# Altium project NixieClock_B1.PrjPcb
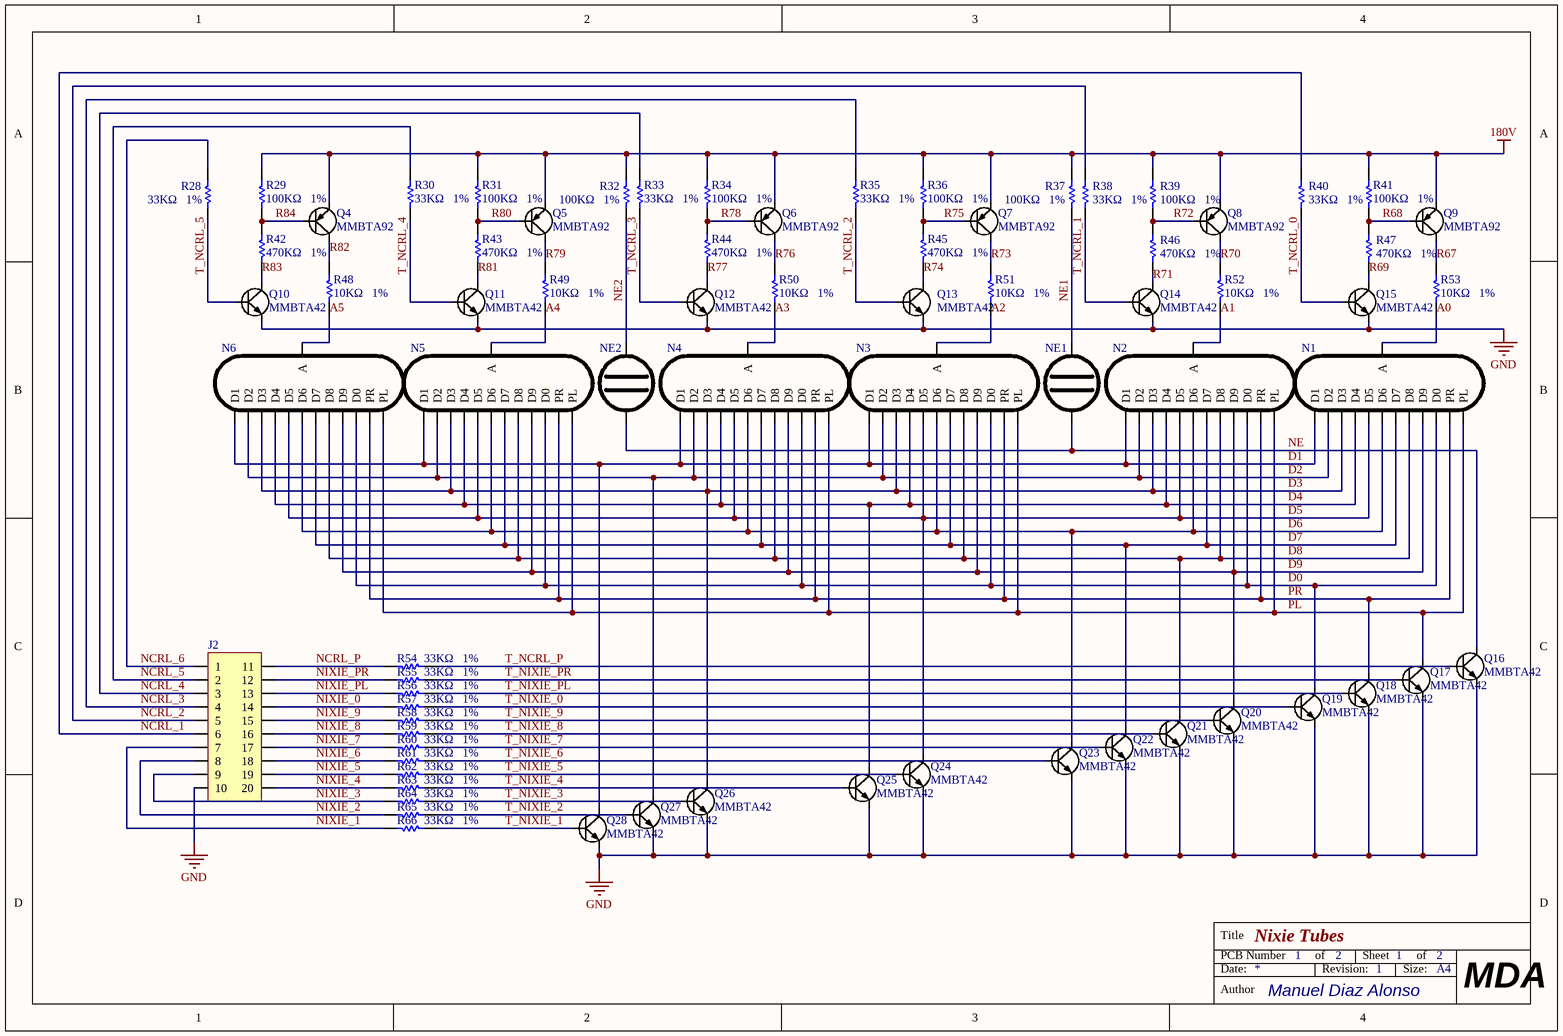
[diagram p0: nixie_tube.SchDoc]
2 sheets, 112 parts. Net scope: global (net labels, ports and power ports of the same name join across sheets).
Board file: NixieClock_B1.PcbDoc
Sheets:
  nixie_tube.SchDoc
  nixie_light.SchDoc

## Sheet nixie_tube.SchDoc: Nixie Tubes
size A4; Author: Manuel Diaz Alonso; Address1: 1; Address2: 2; Revision: 1; SheetNumber: 1; SheetTotal: 2

### Parts
J2  PIN_2X10  [PIN_2X10_HDR]  (value not drawn)
N1  NIXIE-IN14  [NIXIE_IN-14]  (value not drawn)
N2  NIXIE-IN14  [NIXIE_IN-14]  (value not drawn)
N3  NIXIE-IN14  [NIXIE_IN-14]  (value not drawn)
N4  NIXIE-IN14  [NIXIE_IN-14]  (value not drawn)
N5  NIXIE-IN14  [NIXIE_IN-14]  (value not drawn)
N6  NIXIE-IN14  [NIXIE_IN-14]  (value not drawn)
NE1  NIXIE-IN3  [NIXIE_IN-3]  (value not drawn)
NE2  NIXIE-IN3  [NIXIE_IN-3]  (value not drawn)
Q4  MMBTA92  [SOT-23]
Q5  MMBTA92  [SOT-23]
Q6  MMBTA92  [SOT-23]
Q7  MMBTA92  [SOT-23]
Q8  MMBTA92  [SOT-23]
Q9  MMBTA92  [SOT-23]
Q10  MMBTA42  [SOT-23]
Q11  MMBTA42  [SOT-23]
Q12  MMBTA42  [SOT-23]
Q13  MMBTA42  [SOT-23]
Q14  MMBTA42  [SOT-23]
Q15  MMBTA42  [SOT-23]
Q16  MMBTA42  [SOT-23]
Q17  MMBTA42  [SOT-23]
Q18  MMBTA42  [SOT-23]
Q19  MMBTA42  [SOT-23]
Q20  MMBTA42  [SOT-23]
Q21  MMBTA42  [SOT-23]
Q22  MMBTA42  [SOT-23]
Q23  MMBTA42  [SOT-23]
Q24  MMBTA42  [SOT-23]
Q25  MMBTA42  [SOT-23]
Q26  MMBTA42  [SOT-23]
Q27  MMBTA42  [SOT-23]
Q28  MMBTA42  [SOT-23]
R28  33KΩ   1%  [0603]
R29  100KΩ   1%  [0603]
R30  33KΩ   1%  [0603]
R31  100KΩ   1%  [0603]
R32  100KΩ   1%  [0603]
R33  33KΩ   1%  [0603]
R34  100KΩ   1%  [0603]
R35  33KΩ   1%  [0603]
R36  100KΩ   1%  [0603]
R37  100KΩ   1%  [0603]
R38  33KΩ   1%  [0603]
R39  100KΩ   1%  [0603]
R40  33KΩ   1%  [0603]
R41  100KΩ   1%  [0603]
R42  470KΩ   1%  [0603]
R43  470KΩ   1%  [0603]
R44  470KΩ   1%  [0603]
R45  470KΩ   1%  [0603]
R46  470KΩ   1%  [0603]
R47  470KΩ   1%  [0603]
R48  10KΩ   1%  [0603]
R49  10KΩ   1%  [0603]
R50  10KΩ   1%  [0603]
R51  10KΩ   1%  [0603]
R52  10KΩ   1%  [0603]
R53  10KΩ   1%  [0603]
R54  33KΩ   1%  [0603]
R55  33KΩ   1%  [0603]
R56  33KΩ   1%  [0603]
R57  33KΩ   1%  [0603]
R58  33KΩ   1%  [0603]
R59  33KΩ   1%  [0603]
R60  33KΩ   1%  [0603]
R61  33KΩ   1%  [0603]
R62  33KΩ   1%  [0603]
R63  33KΩ   1%  [0603]
R64  33KΩ   1%  [0603]
R65  33KΩ   1%  [0603]
R66  33KΩ   1%  [0603]

### Nets
180V: Q4.2(E) Q5.2(E) Q6.2(E) Q7.2(E) Q8.2(E) Q9.2(E) R29.2 R31.2 R32.2 R34.2 R36.2 R37.2 R39.2 R41.2
GND: J2.10 Q10.2(E) Q11.2(E) Q12.2(E) Q13.2(E) Q14.2(E) Q15.2(E) Q16.2(E) Q17.2(E) Q18.2(E) Q19.2(E) Q20.2(E) Q21.2(E) Q22.2(E) Q23.2(E) Q24.2(E) Q25.2(E) Q26.2(E) Q27.2(E) Q28.2(E)
A0: N1.1(A) R53.1
A1: N2.1(A) R52.1
A2: N3.1(A) R51.1
A3: N4.1(A) R50.1
A4: N5.1(A) R49.1
A5: N6.1(A) R48.1
D0: N1.12(D0) N2.12(D0) N3.12(D0) N4.12(D0) N5.12(D0) N6.12(D0) Q19.3(C)
D1: N1.3(D1) N2.3(D1) N3.3(D1) N4.3(D1) N5.3(D1) N6.3(D1) Q28.3(C)
D2: N1.4(D2) N2.4(D2) N3.4(D2) N4.4(D2) N5.4(D2) N6.4(D2) Q27.3(C)
D3: N1.5(D3) N2.5(D3) N3.5(D3) N4.5(D3) N5.5(D3) N6.5(D3) Q26.3(C)
D4: N1.6(D4) N2.6(D4) N3.6(D4) N4.6(D4) N5.6(D4) N6.6(D4) Q25.3(C)
D5: N1.7(D5) N2.7(D5) N3.7(D5) N4.7(D5) N5.7(D5) N6.7(D5) Q24.3(C)
D6: N1.8(D6) N2.8(D6) N3.8(D6) N4.8(D6) N5.8(D6) N6.8(D6) Q23.3(C)
D7: N1.9(D7) N2.9(D7) N3.9(D7) N4.9(D7) N5.9(D7) N6.9(D7) Q22.3(C)
D8: N1.10(D8) N2.10(D8) N3.10(D8) N4.10(D8) N5.10(D8) N6.10(D8) Q21.3(C)
D9: N1.11(D9) N2.11(D9) N3.11(D9) N4.11(D9) N5.11(D9) N6.11(D9) Q20.3(C)
NCRL_1: J2.6 R40.1
NCRL_2: J2.5 R38.2
NCRL_3: J2.4 R35.2
NCRL_4: J2.3 R33.1
NCRL_5: J2.2 R30.2
NCRL_6: J2.1 R28.2
NCRL_P: J2.11 R54.1
NE: NE1.2 NE2.2 Q16.3(C)
NE1: NE1.1 R37.1
NE2: NE2.1 R32.1
NIXIE_0: J2.14 R57.1
NIXIE_1: J2.7 R66.1
NIXIE_2: J2.8 R65.1
NIXIE_3: J2.9 R64.1
NIXIE_4: J2.20 R63.1
NIXIE_5: J2.19 R62.1
NIXIE_6: J2.18 R61.1
NIXIE_7: J2.17 R60.1
NIXIE_8: J2.16 R59.1
NIXIE_9: J2.15 R58.1
NIXIE_PL: J2.13 R56.1
NIXIE_PR: J2.12 R55.1
PL: N1.2(PL) N2.2(PL) N3.2(PL) N4.2(PL) N5.2(PL) N6.2(PL) Q17.3(C)
PR: N1.13(PR) N2.13(PR) N3.13(PR) N4.13(PR) N5.13(PR) N6.13(PR) Q18.3(C)
R67: Q9.3(C) R53.2
R68: Q9.1(B) R41.1 R47.2
R69: Q15.3(C) R47.1
R70: Q8.3(C) R52.2
R71: Q14.3(C) R46.1
R72: Q8.1(B) R39.1 R46.2
R73: Q7.3(C) R51.2
R74: Q13.3(C) R45.1
R75: Q7.1(B) R36.1 R45.2
R76: Q6.3(C) R50.2
R77: Q12.3(C) R44.1
R78: Q6.1(B) R34.1 R44.2
R79: Q5.3(C) R49.2
R80: Q5.1(B) R31.1 R43.2
R81: Q11.3(C) R43.1
R82: Q4.3(C) R48.2
R83: Q10.3(C) R42.1
R84: Q4.1(B) R29.1 R42.2
T_NCRL_0: Q15.1(B) R40.2
T_NCRL_1: Q14.1(B) R38.1
T_NCRL_2: Q13.1(B) R35.1
T_NCRL_3: Q12.1(B) R33.2
T_NCRL_4: Q11.1(B) R30.1
T_NCRL_5: Q10.1(B) R28.1
T_NCRL_P: Q16.1(B) R54.2
T_NIXIE_0: Q19.1(B) R57.2
T_NIXIE_1: Q28.1(B) R66.2
T_NIXIE_2: Q27.1(B) R65.2
T_NIXIE_3: Q26.1(B) R64.2
T_NIXIE_4: Q25.1(B) R63.2
T_NIXIE_5: Q24.1(B) R62.2
T_NIXIE_6: Q23.1(B) R61.2
T_NIXIE_7: Q22.1(B) R60.2
T_NIXIE_8: Q21.1(B) R59.2
T_NIXIE_9: Q20.1(B) R58.2
T_NIXIE_PL: Q18.1(B) R56.2
T_NIXIE_PR: Q17.1(B) R55.2

### Notes on the sheet
- Title
- PCB Number
- Date:
- of
- Revision:
- Sheet
- Size:
- A4
- Author
- MDA

### Library data of the parts
J2 = PIN_2X10: TSW-110-15-F-D-LL; System: Connector
Q4-Q9 = PNP
Q10-Q28 = NPN
R28-R66 = RES

## Sheet nixie_light.SchDoc: Nixie Lights
size A4; Author: Manuel Diaz Alonso; Address1: 1; Address2: 2; Revision: 1; SheetNumber: 2; SheetTotal: 2
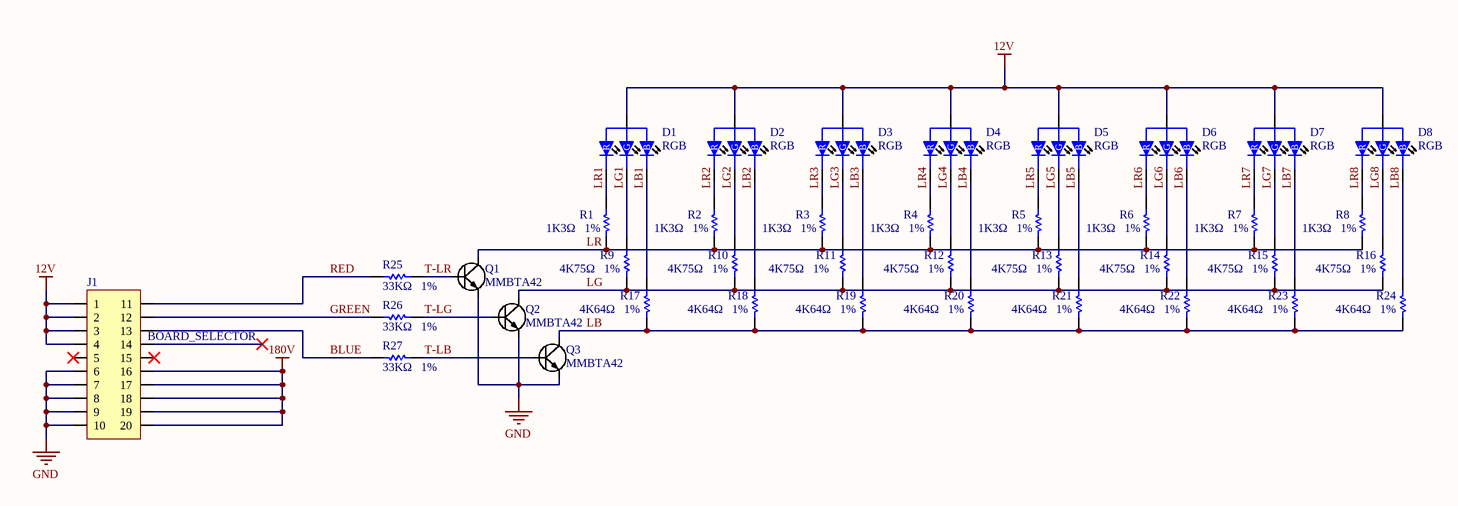
[diagram p1: nixie_light.SchDoc]

### Parts
D1  RGB  [1210-RGB]
D2  RGB  [1210-RGB]
D3  RGB  [1210-RGB]
D4  RGB  [1210-RGB]
D5  RGB  [1210-RGB]
D6  RGB  [1210-RGB]
D7  RGB  [1210-RGB]
D8  RGB  [1210-RGB]
J1  PIN_2X10  [PIN_2X10_HDR]  (value not drawn)
Q1  MMBTA42  [SOT-23]
Q2  MMBTA42  [SOT-23]
Q3  MMBTA42  [SOT-23]
R1  1K3Ω   1%  [0603]
R2  1K3Ω   1%  [0603]
R3  1K3Ω   1%  [0603]
R4  1K3Ω   1%  [0603]
R5  1K3Ω   1%  [0603]
R6  1K3Ω   1%  [0603]
R7  1K3Ω   1%  [0603]
R8  1K3Ω   1%  [0603]
R9  4K75Ω   1%  [0603]
R10  4K75Ω   1%  [0603]
R11  4K75Ω   1%  [0603]
R12  4K75Ω   1%  [0603]
R13  4K75Ω   1%  [0603]
R14  4K75Ω   1%  [0603]
R15  4K75Ω   1%  [0603]
R16  4K75Ω   1%  [0603]
R17  4K64Ω   1%  [0603]
R18  4K64Ω   1%  [0603]
R19  4K64Ω   1%  [0603]
R20  4K64Ω   1%  [0603]
R21  4K64Ω   1%  [0603]
R22  4K64Ω   1%  [0603]
R23  4K64Ω   1%  [0603]
R24  4K64Ω   1%  [0603]
R25  33KΩ   1%  [0603]
R26  33KΩ   1%  [0603]
R27  33KΩ   1%  [0603]

### Nets
12V: D1.2(A) D2.2(A) D3.2(A) D4.2(A) D5.2(A) D6.2(A) D7.2(A) D8.2(A) J1.1 J1.2 J1.3 J1.4
180V: J1.16 J1.17 J1.18 J1.19 J1.20
GND: J1.6 J1.7 J1.8 J1.9 J1.10 Q1.2(E) Q2.2(E) Q3.2(E)
BLUE: J1.13 R27.1
GREEN: J1.12 R26.1
LB: Q3.3(C) R17.1 R18.1 R19.1 R20.1 R21.1 R22.1 R23.1 R24.1
LB1: D1.3(B) R17.2
LB2: D2.3(B) R18.2
LB3: D3.3(B) R19.2
LB4: D4.3(B) R20.2
LB5: D5.3(B) R21.2
LB6: D6.3(B) R22.2
LB7: D7.3(B) R23.2
LB8: D8.3(B) R24.2
LG: Q2.3(C) R9.1 R10.1 R11.1 R12.1 R13.1 R14.1 R15.1 R16.1
LG1: D1.4(G) R9.2
LG2: D2.4(G) R10.2
LG3: D3.4(G) R11.2
LG4: D4.4(G) R12.2
LG5: D5.4(G) R13.2
LG6: D6.4(G) R14.2
LG7: D7.4(G) R15.2
LG8: D8.4(G) R16.2
LR: Q1.3(C) R1.1 R2.1 R3.1 R4.1 R5.1 R6.1 R7.1 R8.1
LR1: D1.1(R) R1.2
LR2: D2.1(R) R2.2
LR3: D3.1(R) R3.2
LR4: D4.1(R) R4.2
LR5: D5.1(R) R5.2
LR6: D6.1(R) R6.2
LR7: D7.1(R) R7.2
LR8: D8.1(R) R8.2
RED: J1.11 R25.1
T-LB: Q3.1(B) R27.2
T-LG: Q2.1(B) R26.2
T-LR: Q1.1(B) R25.2

Not connected (* = marked no-connect by the designer): J1 5* 14* 15*

### Notes on the sheet
- (near J1) BOARD_SELECTOR
- Title
- PCB Number
- Date:
- of
- Revision:
- Sheet
- Size:
- A4
- Author
- MDA

### Library data of the parts
D1-D8 = RGB: qblp655-rgb
J1 = PIN_2X10: TSW-110-15-F-D-LL; System: Connector
Q1-Q3 = NPN
R1-R27 = RES

## Nets that join several sheets
180V: nixie_tube (14 pins), nixie_light (5 pins)
GND: nixie_tube (20 pins), nixie_light (8 pins)